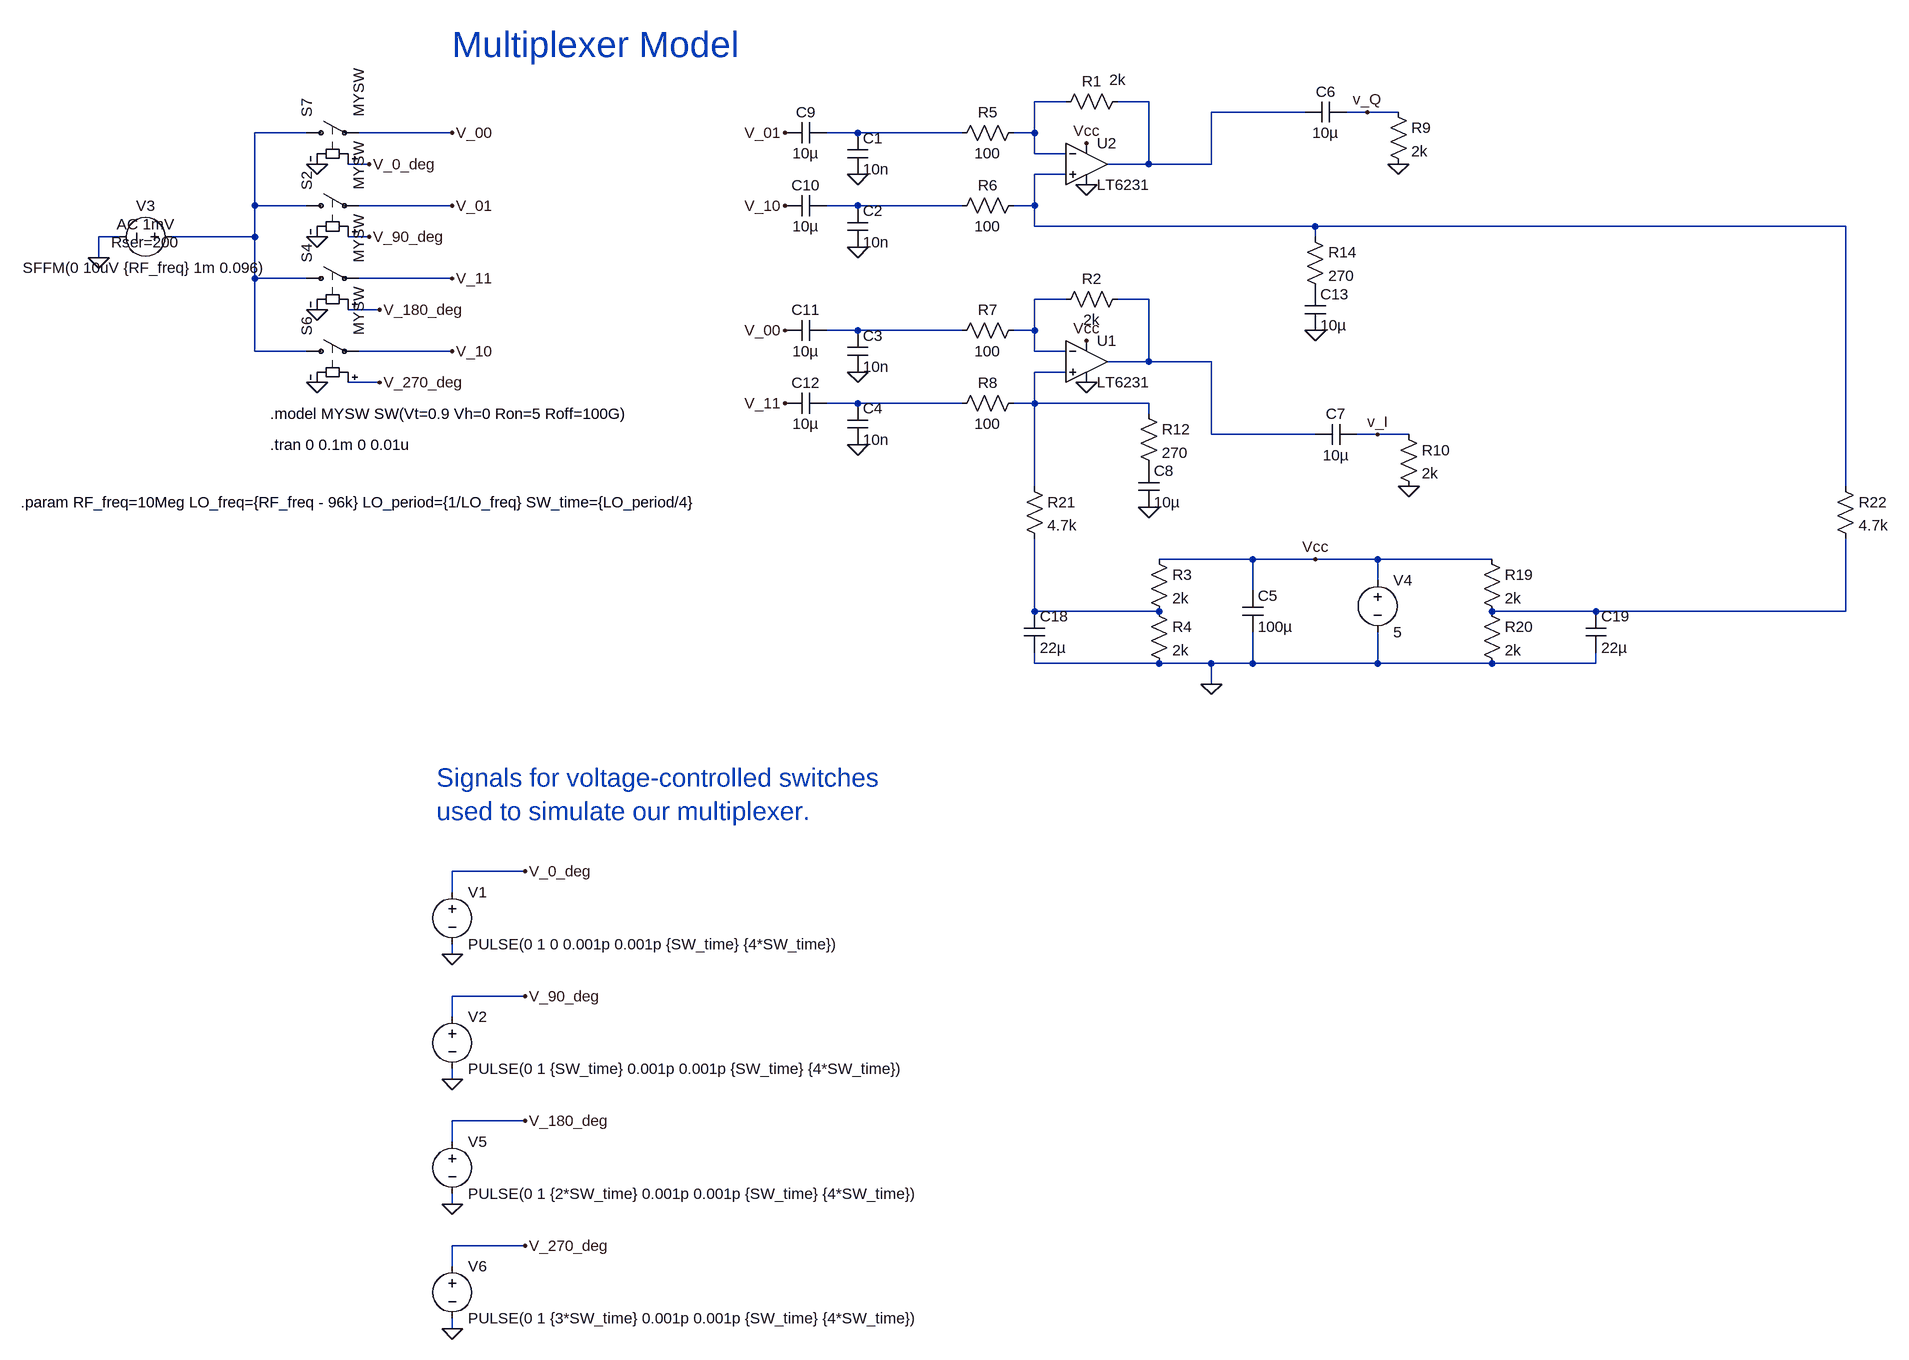
[diagram p0: schematic MUXModel_5.asc]
MUXModel_5.asc, the LTspice schematic file:
Version 4
SHEET 1 2640 1364
WIRE 896 -544 848 -544
WIRE 1024 -544 976 -544
WIRE 1264 -528 1120 -528
WIRE 1360 -528 1328 -528
WIRE 1408 -528 1360 -528
WIRE -272 -496 -352 -496
WIRE -48 -496 -192 -496
WIRE 576 -496 528 -496
WIRE 736 -496 576 -496
WIRE 848 -496 848 -544
WIRE 848 -496 816 -496
WIRE 848 -464 848 -496
WIRE 896 -464 848 -464
WIRE -176 -448 -208 -448
WIRE 1024 -448 1024 -544
WIRE 1024 -448 960 -448
WIRE 1120 -448 1120 -528
WIRE 1120 -448 1024 -448
WIRE 896 -432 848 -432
WIRE -352 -384 -352 -496
WIRE -272 -384 -352 -384
WIRE -48 -384 -192 -384
WIRE 576 -384 528 -384
WIRE 736 -384 576 -384
WIRE 848 -384 848 -432
WIRE 848 -384 816 -384
WIRE 848 -352 848 -384
WIRE 1280 -352 848 -352
WIRE 2096 -352 1280 -352
WIRE -560 -336 -592 -336
WIRE -352 -336 -352 -384
WIRE -352 -336 -480 -336
WIRE -176 -336 -208 -336
WIRE 1280 -336 1280 -352
WIRE -592 -304 -592 -336
WIRE -352 -272 -352 -336
WIRE -272 -272 -352 -272
WIRE -48 -272 -192 -272
WIRE 896 -240 848 -240
WIRE 1024 -240 976 -240
WIRE -160 -224 -208 -224
WIRE 576 -192 528 -192
WIRE 736 -192 576 -192
WIRE 848 -192 848 -240
WIRE 848 -192 816 -192
WIRE -352 -160 -352 -272
WIRE -272 -160 -352 -160
WIRE -48 -160 -192 -160
WIRE 848 -160 848 -192
WIRE 896 -160 848 -160
WIRE 1024 -144 1024 -240
WIRE 1024 -144 960 -144
WIRE 1120 -144 1024 -144
WIRE 896 -128 848 -128
WIRE -160 -112 -208 -112
WIRE 576 -80 528 -80
WIRE 736 -80 576 -80
WIRE 848 -80 848 -128
WIRE 848 -80 816 -80
WIRE 1024 -80 848 -80
WIRE 1024 -64 1024 -80
WIRE 1120 -32 1120 -144
WIRE 1280 -32 1120 -32
WIRE 1376 -32 1344 -32
WIRE 1424 -32 1376 -32
WIRE 848 48 848 -80
WIRE 2096 48 2096 -352
WIRE 1184 160 1040 160
WIRE 1280 160 1184 160
WIRE 1376 160 1280 160
WIRE 1552 160 1376 160
WIRE 1376 192 1376 160
WIRE 1184 208 1184 160
WIRE 848 240 848 128
WIRE 1040 240 848 240
WIRE 1712 240 1552 240
WIRE 2096 240 2096 128
WIRE 2096 240 1712 240
WIRE 848 320 848 304
WIRE 1040 320 848 320
WIRE 1120 320 1040 320
WIRE 1184 320 1184 272
WIRE 1184 320 1120 320
WIRE 1376 320 1376 272
WIRE 1376 320 1184 320
WIRE 1552 320 1376 320
WIRE 1712 320 1712 304
WIRE 1712 320 1552 320
WIRE 1120 352 1120 320
WIRE 64 640 -48 640
WIRE -48 672 -48 640
WIRE -48 768 -48 752
WIRE 64 832 -48 832
WIRE -48 864 -48 832
WIRE -48 960 -48 944
WIRE 64 1024 -48 1024
WIRE -48 1056 -48 1024
WIRE -48 1152 -48 1136
WIRE 64 1216 -48 1216
WIRE -48 1248 -48 1216
WIRE -48 1344 -48 1328
FLAG -256 -448 0
FLAG -256 -336 0
FLAG -256 -224 0
FLAG -256 -112 0
FLAG -592 -304 0
FLAG 576 -432 0
FLAG 576 -320 0
FLAG 576 -128 0
FLAG 576 -16 0
FLAG 928 -416 0
FLAG 928 -112 0
FLAG 1120 352 0
FLAG 1280 160 Vcc
FLAG 928 -176 Vcc
FLAG 928 -480 Vcc
FLAG 1424 48 0
FLAG 1408 -448 0
FLAG -160 -112 V_270_deg
FLAG -160 -224 V_180_deg
FLAG -176 -336 V_90_deg
FLAG -176 -448 V_0_deg
FLAG -48 768 0
FLAG 64 640 V_0_deg
FLAG -48 960 0
FLAG 64 832 V_90_deg
FLAG -48 1152 0
FLAG 64 1024 V_180_deg
FLAG -48 1344 0
FLAG 64 1216 V_270_deg
FLAG 1360 -528 v_Q
FLAG 1376 -32 v_I
FLAG -48 -496 V_00
FLAG -48 -384 V_01
FLAG -48 -272 V_11
FLAG 464 -496 V_01
FLAG 464 -384 V_10
FLAG 464 -192 V_00
FLAG 464 -80 V_11
FLAG -48 -160 V_10
FLAG 1024 80 0
FLAG 1280 -192 0
SYMBOL sw -288 -496 R270
SYMATTR InstName S7
SYMATTR Value MYSW
SYMBOL sw -288 -384 R270
SYMATTR InstName S2
SYMATTR Value MYSW
SYMBOL sw -288 -272 R270
SYMATTR InstName S4
SYMATTR Value MYSW
SYMBOL sw -288 -160 R270
SYMATTR InstName S6
SYMATTR Value MYSW
SYMBOL voltage -464 -336 R90
WINDOW 0 -32 56 VBottom 2
WINDOW 3 32 56 VTop 2
WINDOW 123 -4 56 VBottom 2
WINDOW 39 24 56 VBottom 2
SYMATTR InstName V3
SYMATTR Value SFFM(0 10uV {RF_freq} 1m 0.096)
SYMATTR Value2 AC 1mV
SYMATTR SpiceLine Rser=200
SYMBOL cap 560 -496 R0
SYMATTR InstName C1
SYMATTR Value 10n
SYMBOL cap 560 -384 R0
SYMATTR InstName C2
SYMATTR Value 10n
SYMBOL cap 560 -192 R0
SYMATTR InstName C3
SYMATTR Value 10n
SYMBOL cap 560 -80 R0
SYMATTR InstName C4
SYMATTR Value 10n
SYMBOL res 832 -512 R90
WINDOW 0 0 56 VBottom 2
WINDOW 3 32 56 VTop 2
SYMATTR InstName R5
SYMATTR Value 100
SYMBOL res 832 -400 R90
WINDOW 0 0 56 VBottom 2
WINDOW 3 32 56 VTop 2
SYMATTR InstName R6
SYMATTR Value 100
SYMBOL res 832 -208 R90
WINDOW 0 0 56 VBottom 2
WINDOW 3 32 56 VTop 2
SYMATTR InstName R7
SYMATTR Value 100
SYMBOL res 832 -96 R90
WINDOW 0 0 56 VBottom 2
WINDOW 3 32 56 VTop 2
SYMATTR InstName R8
SYMATTR Value 100
SYMBOL cap 528 -512 R90
WINDOW 0 0 32 VBottom 2
WINDOW 3 32 32 VTop 2
SYMATTR InstName C9
SYMATTR Value 10µ
SYMBOL cap 528 -400 R90
WINDOW 0 0 32 VBottom 2
WINDOW 3 32 32 VTop 2
SYMATTR InstName C10
SYMATTR Value 10µ
SYMBOL cap 528 -208 R90
WINDOW 0 0 32 VBottom 2
WINDOW 3 32 32 VTop 2
SYMATTR InstName C11
SYMATTR Value 10µ
SYMBOL cap 528 -96 R90
WINDOW 0 0 32 VBottom 2
WINDOW 3 32 32 VTop 2
SYMATTR InstName C12
SYMATTR Value 10µ
SYMBOL res 992 -560 R90
WINDOW 0 0 56 VBottom 2
WINDOW 3 -33 16 VTop 2
SYMATTR InstName R1
SYMATTR Value 2k
SYMBOL res 992 -256 R90
WINDOW 0 0 56 VBottom 2
WINDOW 3 32 56 VTop 2
SYMATTR InstName R2
SYMATTR Value 2k
SYMBOL res 1024 144 R0
SYMATTR InstName R3
SYMATTR Value 2k
SYMBOL res 1024 224 R0
SYMATTR InstName R4
SYMATTR Value 2k
SYMBOL cap 1168 208 R0
SYMATTR InstName C5
SYMATTR Value 100µ
SYMBOL voltage 1376 176 R0
WINDOW 123 0 0 Left 0
WINDOW 39 24 124 Left 2
SYMATTR InstName V4
SYMATTR Value 5
SYMBOL cap 1328 -544 R90
WINDOW 0 0 32 VBottom 2
WINDOW 3 32 32 VTop 2
SYMATTR InstName C6
SYMATTR Value 10µ
SYMBOL cap 1344 -48 R90
WINDOW 0 0 32 VBottom 2
WINDOW 3 32 32 VTop 2
SYMATTR InstName C7
SYMATTR Value 10µ
SYMBOL res 1392 -544 R0
SYMATTR InstName R9
SYMATTR Value 2k
SYMBOL res 1408 -48 R0
SYMATTR InstName R10
SYMATTR Value 2k
SYMBOL OpAmps\\LT6231 928 -144 R0
SYMATTR InstName U1
SYMBOL OpAmps\\LT6231 928 -448 R0
SYMATTR InstName U2
SYMBOL res 1536 144 R0
SYMATTR InstName R19
SYMATTR Value 2k
SYMBOL res 1536 224 R0
SYMATTR InstName R20
SYMATTR Value 2k
SYMBOL voltage -48 656 R0
WINDOW 123 0 0 Left 0
WINDOW 39 0 0 Left 0
SYMATTR InstName V1
SYMATTR Value PULSE(0 1 0 0.001p 0.001p {SW_time} {4*SW_time})
SYMBOL voltage -48 848 R0
WINDOW 123 0 0 Left 0
WINDOW 39 0 0 Left 0
SYMATTR InstName V2
SYMATTR Value PULSE(0 1 {SW_time} 0.001p 0.001p {SW_time} {4*SW_time})
SYMBOL voltage -48 1040 R0
WINDOW 123 0 0 Left 0
WINDOW 39 0 0 Left 0
SYMATTR InstName V5
SYMATTR Value PULSE(0 1 {2*SW_time} 0.001p 0.001p {SW_time} {4*SW_time})
SYMBOL voltage -48 1232 R0
WINDOW 123 0 0 Left 0
WINDOW 39 0 0 Left 0
SYMATTR InstName V6
SYMATTR Value PULSE(0 1 {3*SW_time} 0.001p 0.001p {SW_time} {4*SW_time})
SYMBOL res 832 32 R0
SYMATTR InstName R21
SYMATTR Value 4.7k
SYMBOL res 2080 32 R0
SYMATTR InstName R22
SYMATTR Value 4.7k
SYMBOL cap 832 240 R0
SYMATTR InstName C18
SYMATTR Value 22µ
SYMBOL cap 1696 240 R0
SYMATTR InstName C19
SYMATTR Value 22µ
SYMBOL res 1008 -80 R0
SYMATTR InstName R12
SYMATTR Value 270
SYMBOL cap 1008 16 R0
SYMATTR InstName C8
SYMATTR Value 10µ
SYMBOL res 1264 -352 R0
SYMATTR InstName R14
SYMATTR Value 270
SYMBOL cap 1264 -256 R0
SYMATTR InstName C13
SYMATTR Value 10µ
TEXT -328 -64 Left 2 !.model MYSW SW(Vt=0.9 Vh=0 Ron=5 Roff=100G)
TEXT -328 -16 Left 2 !.tran 0 0.1m 0 0.01u
TEXT -48 -632 Left 5 ;Multiplexer Model
TEXT -72 496 Left 4 ;Signals for voltage-controlled switches \nused to simulate our multiplexer.
TEXT -712 72 Left 2 !.param RF_freq=10Meg LO_freq={RF_freq - 96k} LO_period={1/LO_freq} SW_time={LO_period/4}

The netlist it stands for:
* MUXModel_5.asc
S7 N003 V_00 V_0_deg 0 MYSW
S2 N003 V_01 V_90_deg 0 MYSW
S4 N003 V_11 V_180_deg 0 MYSW
S6 N003 V_10 V_270_deg 0 MYSW
V3 N003 0 SFFM(0 10uV {RF_freq} 1m 0.096) AC 1mV Rser=200
C1 N004 0 10n
C2 N006 0 10n
C3 N009 0 10n
C4 N011 0 10n
R5 N001 N004 100
R6 N005 N006 100
R7 N007 N009 100
R8 N010 N011 100
C9 N004 V_01 10µ
C10 N006 V_10 10µ
C11 N009 V_00 10µ
C12 N011 V_11 10µ
R1 N002 N001 2k
R2 N008 N007 2k
R3 Vcc N012 2k
R4 N012 0 2k
C5 Vcc 0 100µ
V4 Vcc 0 5
C6 v_Q N002 10µ
C7 v_I N008 10µ
R9 v_Q 0 2k
R10 v_I 0 2k
XU1 N010 N007 N008 Vcc 0 LT6231  ; pins In+ In- OUT V+ V-
XU2 N005 N001 N002 Vcc 0 LT6231  ; pins In+ In- OUT V+ V-
R19 Vcc N013 2k
R20 N013 0 2k
V1 V_0_deg 0 PULSE(0 1 0 0.001p 0.001p {SW_time} {4*SW_time})
V2 V_90_deg 0 PULSE(0 1 {SW_time} 0.001p 0.001p {SW_time} {4*SW_time})
V5 V_180_deg 0 PULSE(0 1 {2*SW_time} 0.001p 0.001p {SW_time} {4*SW_time})
V6 V_270_deg 0 PULSE(0 1 {3*SW_time} 0.001p 0.001p {SW_time} {4*SW_time})
R21 N010 N012 4.7k
R22 N005 N013 4.7k
C18 N012 0 22µ
C19 N013 0 22µ
R12 N010 P001 270
C8 P001 0 10µ
R14 N005 P002 270
C13 P002 0 10µ
.model MYSW SW(Vt=0.9 Vh=0 Ron=5 Roff=100G)
.tran 0 0.1m 0 0.01u
* Multiplexer Model
* Signals for voltage-controlled switches
* used to simulate our multiplexer.
.param RF_freq=10Meg LO_freq={RF_freq - 96k} LO_period={1/LO_freq} SW_time={LO_period/4}
.lib LTC2.lib
.backanno
.end